# EAGLE design p1-001 (EAGLE 9.6.2)
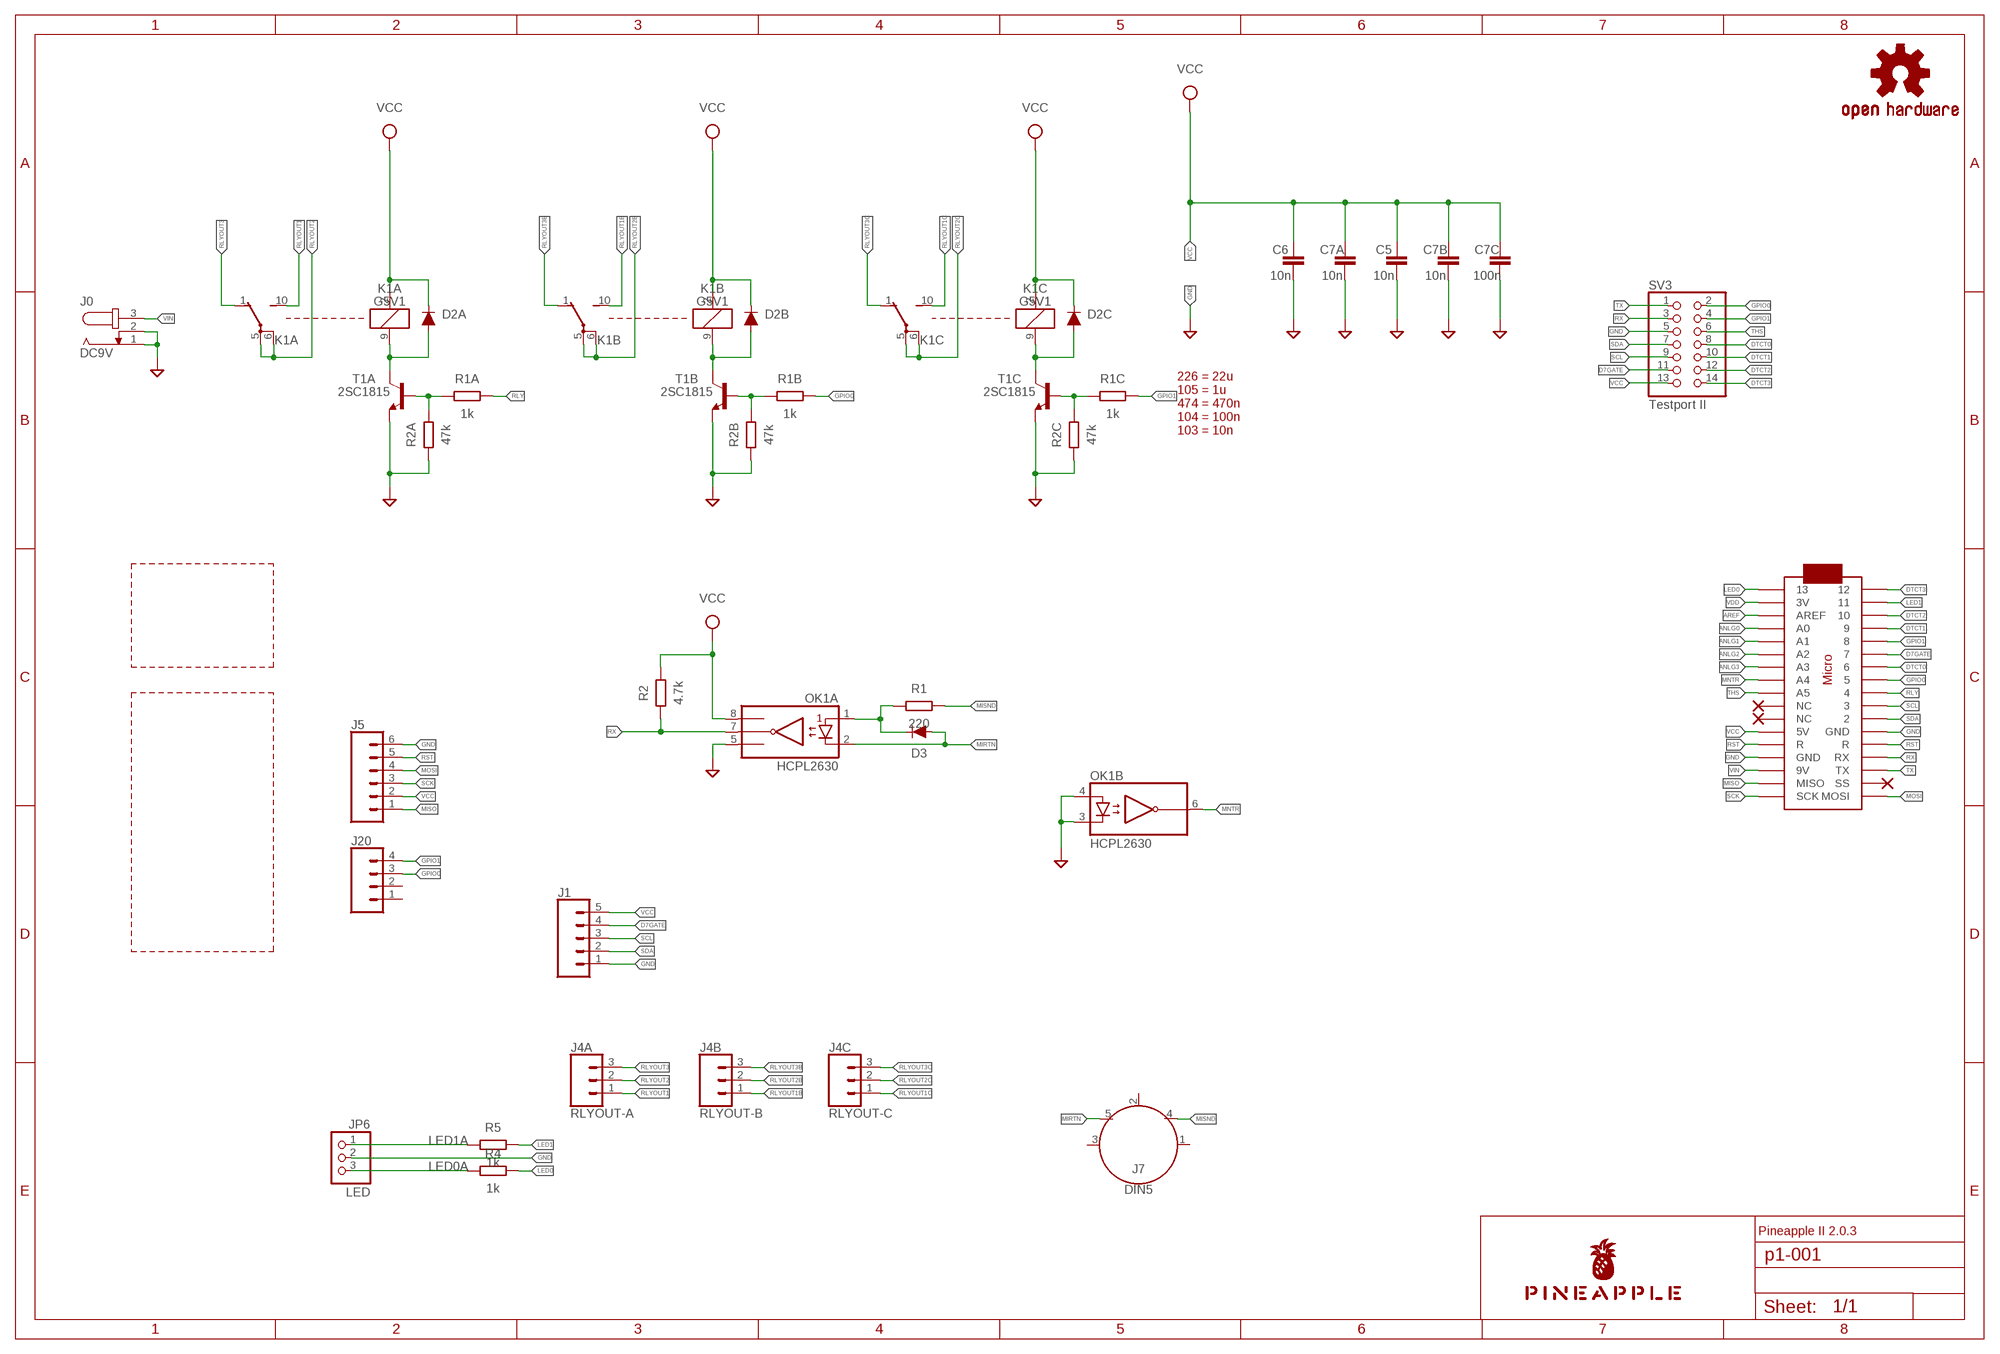
[diagram p0: schematic, sheet 1]

## Parts
C5  10n  C-EU025-024X044  [C025-024X044]
C6  10n  C-EU025-024X044  [C025-024X044]
C7A  10n  C-EU025-024X044  [C025-024X044]
C7B  10n  C-EU025-024X044  [C025-024X044]
C7C  100n  C-EU025-024X044  [C025-024X044]
D2A  DIODE-1N4148  [DIODE-1N4148]
D2B  DIODE-1N4148  [DIODE-1N4148]
D2C  DIODE-1N4148  [DIODE-1N4148]
D3  DIODE-1N4148  [DIODE-1N4148]
J0  DC9V  JACK-PLUG0  [SPC4077]
J1  CONN_05JST  [JST-5-PTH]
J4A  RLYOUT-A  CONN_03JST-PTH  [JST-3-PTH]
J4B  RLYOUT-B  CONN_03JST-PTH  [JST-3-PTH]
J4C  RLYOUT-C  CONN_03JST-PTH  [JST-3-PTH]
J5  CONN_061.27MM  [1X06_1.27MM]
J7  DIN5  [DIN5-RA-PTH]
J20  CONN_041.27MM  [1X04_1.27MM]
JP6  LED  PINHD-1X3  [1X03]
K1A  G5V1  [G5V1]
K1B  G5V1  [G5V1]
K1C  G5V1  [G5V1]
LOGO1  OSHW-LOGOS-COPPER  [OSHW-LOGO-S_COPPER]
MC1  ARDUINOMICRO  [ARDUINOMICRO]
OK1  HCPL2630  [DIL08]
R1  220  R-EU_0204/5  [0204/5]
R1A  1k  R-EU_0204/5  [0204/5]
R1B  1k  R-EU_0204/5  [0204/5]
R1C  1k  R-EU_0204/5  [0204/5]
R2  4.7k  R-EU_0204/5  [0204/5]
R2A  47k  R-EU_0204/5  [0204/5]
R2B  47k  R-EU_0204/5  [0204/5]
R2C  47k  R-EU_0204/5  [0204/5]
R4  1k  R-EU_0204/5  [0204/5]
R5  1k  R-EU_0204/5  [0204/5]
SV3  Testport II  PINHD-2X7  [2X07]
T1A  2SC1815  [TO92-ECB]
T1B  2SC1815  [TO92-ECB]
T1C  2SC1815  [TO92-ECB]
U$1  PINEAPPLE450_SILK  [PINEAPPLE450_SILK]

## Nets
ANLG0 [analog]: MC1.P$31(A0)
ANLG1 [analog]: MC1.P$30(A1)
ANLG2 [analog]: MC1.P$29(A2)
ANLG3 [analog]: MC1.P$28(A3)
AREF: MC1.P$32(AREF)
D7GATE: J1.4 MC1.P$6 SV3.11
DTCT0: MC1.P$7 SV3.8
DTCT1: MC1.P$4 SV3.10
DTCT2: MC1.P$3 SV3.12
DTCT3: MC1.P$1 SV3.14
GND [gnd]: C5.2 C6.2 C7A.2 C7B.2 C7C.2 J0.1 J0.2 J1.1 J5.6 JP6.2 MC1.P$12(GND) MC1.P$21(GND) OK1.3(B:C2) OK1.4(B:A2) OK1.5(A:GND) R2A.1 R2B.1 R2C.1 SV3.5 T1A.E T1B.E T1C.E
GPIO0: J20.3 MC1.P$8 R1B.2 SV3.2
GPIO1: J20.4 MC1.P$5 R1C.2 SV3.4
LED0: MC1.P$34 R4.2
LED0A: JP6.3 R4.1
LED1: MC1.P$2 R5.2
LED1A: JP6.1 R5.1
MIDIINSND: D3.C OK1.1(A:A1) R1.1
MIRTN: D3.A J7.5 OK1.2(A:C1)
MISND: J7.4 R1.2
MISO: J5.1 MC1.P$19(MISO)
MNTR: MC1.P$27(A4) OK1.6(B:VO2)
MOSI: J5.4 MC1.P$17(MOSI)
RLY: MC1.P$9 R1A.2
RLYDRV: R1A.1 R2A.2 T1A.B
RLYDRV1: R1B.1 R2B.2 T1B.B
RLYDRV2: R1C.1 R2C.2 T1C.B
RLYOUT1: J4A.1 K1A.10(2:S)
RLYOUT1B: J4B.1 K1B.10(2:S)
RLYOUT1C: J4C.1 K1C.10(2:S)
RLYOUT2: J4A.2 K1A.5(2:P) K1A.6(2:P)
RLYOUT2B: J4B.2 K1B.5(2:P) K1B.6(2:P)
RLYOUT2C: J4C.2 K1C.5(2:P) K1C.6(2:P)
RLYOUT3: J4A.3 K1A.1(2:O)
RLYOUT3B: J4B.3 K1B.1(2:O)
RLYOUT3C: J4C.3 K1C.1(2:O)
RLYSNK: D2A.A K1A.9 T1A.C
RLYSNK1: D2B.A K1B.9 T1B.C
RLYSNK2: D2C.A K1C.9 T1C.C
RST: J5.5 MC1.P$13(R) MC1.P$22(R)
RX: MC1.P$14(RX) OK1.7(A:VO1) R2.1 SV3.3
SCK: J5.3 MC1.P$18(SCK)
SCL: J1.3 MC1.P$10 SV3.9
SDA: J1.2 MC1.P$11 SV3.7
THS: MC1.P$26(A5) SV3.6
TX: MC1.P$15(TX) SV3.1
VCC [power]: C5.1 C6.1 C7A.1 C7B.1 C7C.1 D2A.C D2B.C D2C.C J1.5 J5.2 K1A.2 K1B.2 K1C.2 MC1.P$23(5V) OK1.8(A:VCC) R2.2 SV3.13
VDD [power]: MC1.P$33(3V)
VIN [superpower]: J0.3 MC1.P$20(9V)
Unconnected: J7.1 J7.2 J7.3 J20.1 J20.2 MC1.P$16(SS) MC1.P$24(NC) MC1.P$25(NC)

## Notes on the sheet
- 226 = 22u
  105 = 1u
  474 = 470n
  104 = 100n
  103 = 10n
- Pineapple II 2.0.3

## Library data of the parts
C5 C6 C7A C7B C7C = resistor:C-EU: CAPACITOR, European symbol
D2A D2B D2C D3 = SparkFun-DiscreteSemi:DIODE: Diode These are standard reverse protection diodes and small signal diodes. SparkFun Products: SparkFun SparkPunk Sound Kit <https://www.sparkfun.com/products/11177> SparkFun ESP8266 Thing <https://www.sparkfun.com/products/13231>; PROD_ID: DIO-08378; VALUE: 200mA/100V/1V
J0 = con-jack:JACK-PLUG: DC POWER JACK Power Jack, DC, Right Angle, Through Hole, Rated 5A at 16VDC, PC Terminals Distributor: Farnell (www.Farnell.de) Drawing: 84N1161.pdf / 84N1162.pdf Manufacturer: SPC Technology (www.spctechnology.com) Type: SPC4077 / SPC 4078; OC_FARNELL: unknown; OC_NEWARK: unknown
J1 = SparkFun-Connectors:CONN_05: Multi connection point. Often used as Generic Header-pin footprint for 0.1 inch spaced/style header connections On any of the 0.1 inch spaced packages, you can populate with these: Break Away Headers - Straight <https://www.sparkfun.com/products/116> (PRT-00116) Break Away Male Headers - Right Angle <https://www.sparkfun.com/products/553> (PRT-00553) Female Headers <https://www.sparkfun.com/products/115> (PRT-00115) Break Away Headers - Machine Pin <https://www.sparkfun.com/products/117> (PRT-00117) Break Away Female Headers - Swiss Machine Pin <https://www.sparkfun.com/products/743> (PRT-00743) For SCREWTERMINALS and SPRING TERMINALS visit here: Screw Terimnals on SparkFun.com <https://www.sparkfun.com/search/results?term=Screw+Terminals> (5mm/3.5mm/2.54mm spacing) This device is also useful as a general connection point to wire up your design to another part of your project. Our various solder wires solder well into these plated through hole pads. Hook-Up Wire - Assortment (Stranded, 22 AWG) <https://www.sparkfun.com/products/11375> (PRT-11375) Hook-Up Wire - Assortment (Solid Core, 22 AWG) <https://www.sparkfun.com/products/11367> (PRT-11367) View the entire wire category on our website here <https://www.sparkfun.com/categories/141> Special notes: Molex polarized connector foot print use with SKU : PRT-08231 with associated crimp pins and housings. 1MM SMD Version SKU: PRT-10208; SF_ID: PRT-09917
J4A J4B J4C = SparkFun-Connectors:CONN_03: Multi connection point. Often used as Generic Header-pin footprint for 0.1 inch spaced/style header connections On any of the 0.1 inch spaced packages, you can populate with these: Break Away Headers - Straight <https://www.sparkfun.com/products/116> (PRT-00116) Break Away Male Headers - Right Angle <https://www.sparkfun.com/products/553> (PRT-00553) Female Headers <https://www.sparkfun.com/products/115> (PRT-00115) Break Away Headers - Machine Pin <https://www.sparkfun.com/products/117> (PRT-00117) Break Away Female Headers - Swiss Machine Pin <https://www.sparkfun.com/products/743> (PRT-00743) Stackable Header - 3 Pin (Female, 0.1") <https://www.sparkfun.com/products/13875> (PRT-13875) For SCREWTERMINALS and SPRING TERMINALS visit here: Screw Terimnals on SparkFun.com <https://www.sparkfun.com/search/results?term=Screw+Terminals> (5mm/3.5mm/2.54mm spacing) This device is also useful as a general connection point to wire up your design to another part of your project. Our various solder wires solder well into these plated through hole pads. Hook-Up Wire - Assortment (Stranded, 22 AWG) <https://www.sparkfun.com/products/11375> (PRT-11375) Hook-Up Wire - Assortment (Solid Core, 22 AWG) <https://www.sparkfun.com/products/11367> (PRT-11367) View the entire wire category on our website here <https://www.sparkfun.com/categories/141> Special notes: Molex polarized connector foot print use with SKU : PRT-08232 with associated crimp pins and housings.; PROD_ID: WIRE-10037; SF_ID: PRT-09915
J5 = SparkFun-Connectors:CONN_06: Multi connection point. Often used as Generic Header-pin footprint for 0.1 inch spaced/style header connections On any of the 0.1 inch spaced packages, you can populate with these: Break Away Headers - Straight <https://www.sparkfun.com/products/116> (PRT-00116) Break Away Male Headers - Right Angle <https://www.sparkfun.com/products/553> (PRT-00553) Female Headers <https://www.sparkfun.com/products/115> (PRT-00115) Break Away Headers - Machine Pin <https://www.sparkfun.com/products/117> (PRT-00117) Break Away Female Headers - Swiss Machine Pin <https://www.sparkfun.com/products/743> (PRT-00743) Arduino Stackable Header - 6 Pin <https://www.sparkfun.com/products/9280> (PRT-09280) For SCREWTERMINALS and SPRING TERMINALS visit here: Screw Terimnals on SparkFun.com <https://www.sparkfun.com/search/results?term=Screw+Terminals> (5mm/3.5mm/2.54mm spacing) This device is also useful as a general connection point to wire up your design to another part of your project. Our various solder wires solder well into these plated through hole pads. Hook-Up Wire - Assortment (Stranded, 22 AWG) <https://www.sparkfun.com/products/11375> (PRT-11375) Hook-Up Wire - Assortment (Solid Core, 22 AWG) <https://www.sparkfun.com/products/11367> (PRT-11367) View the entire wire category on our website here <https://www.sparkfun.com/categories/141>
J7 = SparkFun-Connectors:DIN5: DIN5 Connector - Female Right Angle (frequently used as a MIDI Jack connector) This type of connector and cable is frequently used for transmitting midi data (musical instrument digital interface). It is what you usually see on a keyboard or set of electronic drums. Learn more here <https://en.wikipedia.org/wiki/MIDI>. For more information on the pinout and electrical specifications of MIDI communications, please see the following resource: https://www.midi.org/specifications/item/midi-din-electrical-specification Here is the connector we sell at SparkFun: MIDI Connector - Female Right Angle <https://www.sparkfun.com/products/9536> (PRT-09536) Datasheet <hhttp://www.sparkfun.com/datasheets/Prototyping/Connectors/MIDI-RA.pdf> It is used on this SparkFun product: SparkFun MIDI Shield <https://www.sparkfun.com/products/12898> (DEV-12898); PROD_ID: CONN-09481
J20 = SparkFun-Connectors:CONN_04: Multi connection point. Often used as Generic Header-pin footprint for 0.1 inch spaced/style header connections On any of the 0.1 inch spaced packages, you can populate with these: Break Away Headers - Straight <https://www.sparkfun.com/products/116> (PRT-00116) Break Away Male Headers - Right Angle <https://www.sparkfun.com/products/553> (PRT-00553) Female Headers <https://www.sparkfun.com/products/115> (PRT-00115) Break Away Headers - Machine Pin <https://www.sparkfun.com/products/117> (PRT-00117) Break Away Female Headers - Swiss Machine Pin <https://www.sparkfun.com/products/743> (PRT-00743) For SCREWTERMINALS and SPRING TERMINALS visit here: Screw Terimnals on SparkFun.com <https://www.sparkfun.com/search/results?term=Screw+Terminals> (5mm/3.5mm/2.54mm spacing) This device is also useful as a general connection point to wire up your design to another part of your project. Our various solder wires solder well into these plated through hole pads. Hook-Up Wire - Assortment (Stranded, 22 AWG) <https://www.sparkfun.com/products/11375> (PRT-11375) Hook-Up Wire - Assortment (Solid Core, 22 AWG) <https://www.sparkfun.com/products/11367> (PRT-11367) View the entire wire category on our website here <https://www.sparkfun.com/categories/141> Special notes: Molex polarized connector foot print use with SKU : PRT-08231 with associated crimp pins and housings. 1MM SMD Version SKU: PRT-10208
JP6 = pinhead:PINHD-1X3: PIN HEADER
K1A K1B K1C = relay:G5V1: RELAY 1 x switch, 0.5 A/125 V AC, 1 A/24 V DC , Omron; MPN: G5V-1-DC24; OC_FARNELL: 9949593; OC_NEWARK: 36M6377
LOGO1 = SparkFun-Aesthetics:OSHW-LOGO: Open-Source Hardware (OSHW) Logo This logo indicates the piece of hardware it is found on incorporates a OSHW license and/or adheres to the definition of open source hardware found here: http://freedomdefined.org/OSHW
MC1 = adafruit:ARDUINOMICRO
OK1 = optocoupler:HCPL2630: HEWLETT PACKARD OPTO COUPLER; MF: AGILENT TECHNOLOGIES; MPN: HCPL-2630-000E; OC_FARNELL: 9994904; OC_NEWARK: 88H7813
R1 R1A R1B R1C R2 R2A R2B R2C R4 R5 = resistor:R-EU_: RESISTOR, European symbol
SV3 = pinhead:PINHD-2X7: PIN HEADER
T1A T1B T1C = transistor:2SC1815: NPN EPITAXIAL TRANSISTOR Source: TOSHIBA .. 2SC1815 1.pdf
U$1 = pineapple:PINEAPPLE450_SILK

## Net classes
0 default: width 0.152 mm, drill 0.152 mm, clearance 0.152 mm
1 gnd: width 0.305 mm, drill 0.152 mm, clearance 0.152 mm
2 power: width 0.508 mm, drill 0.152 mm, clearance 0.152 mm
3 analog: width 0.305 mm, drill 0.152 mm, clearance 0.152 mm
4 superpower: width 1.016 mm, drill 0.152 mm, clearance 0.152 mm

## Board
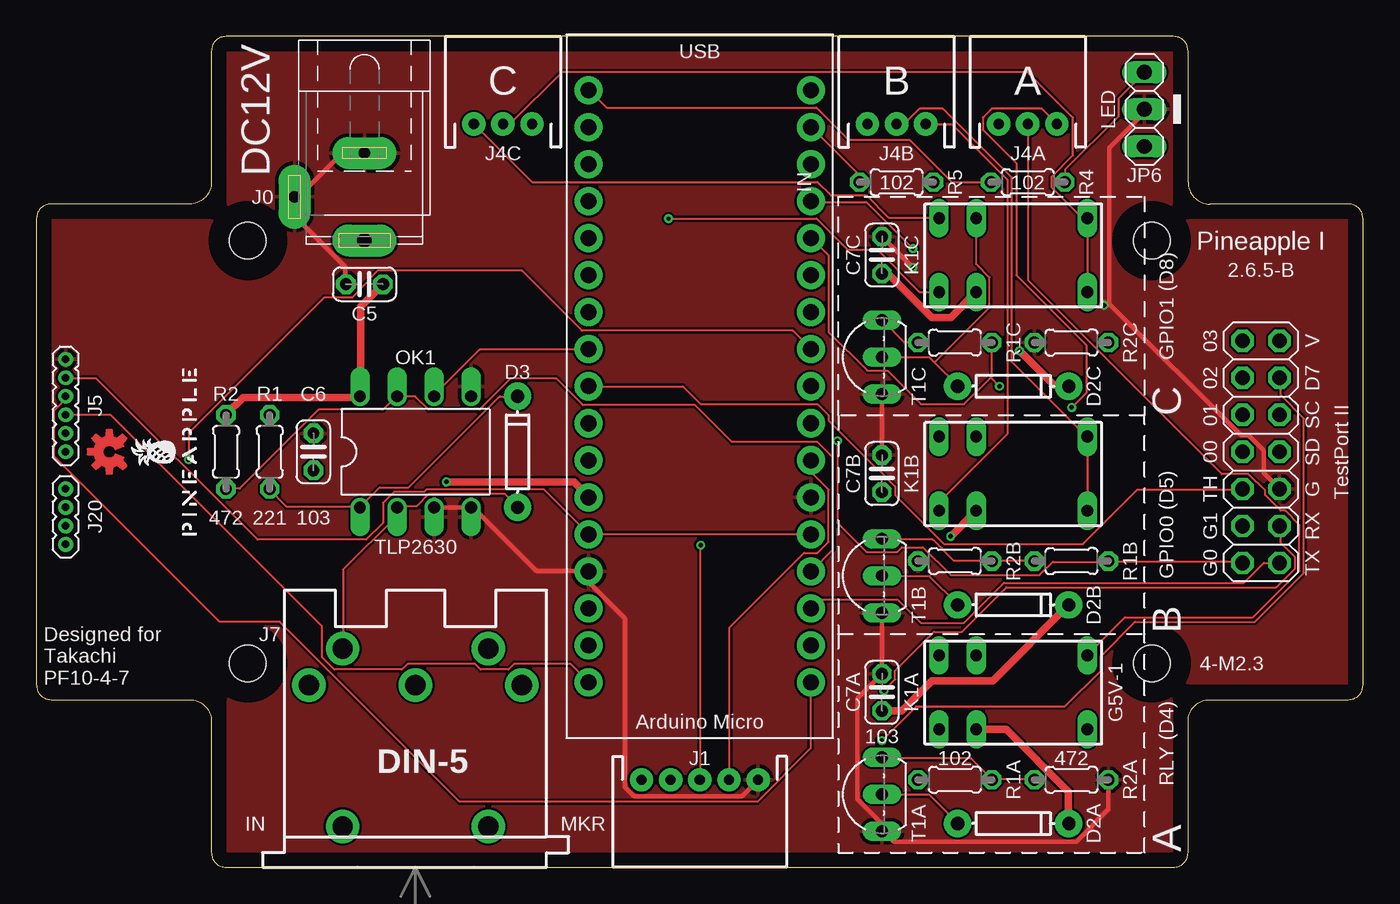
[diagram p1: board, top side]
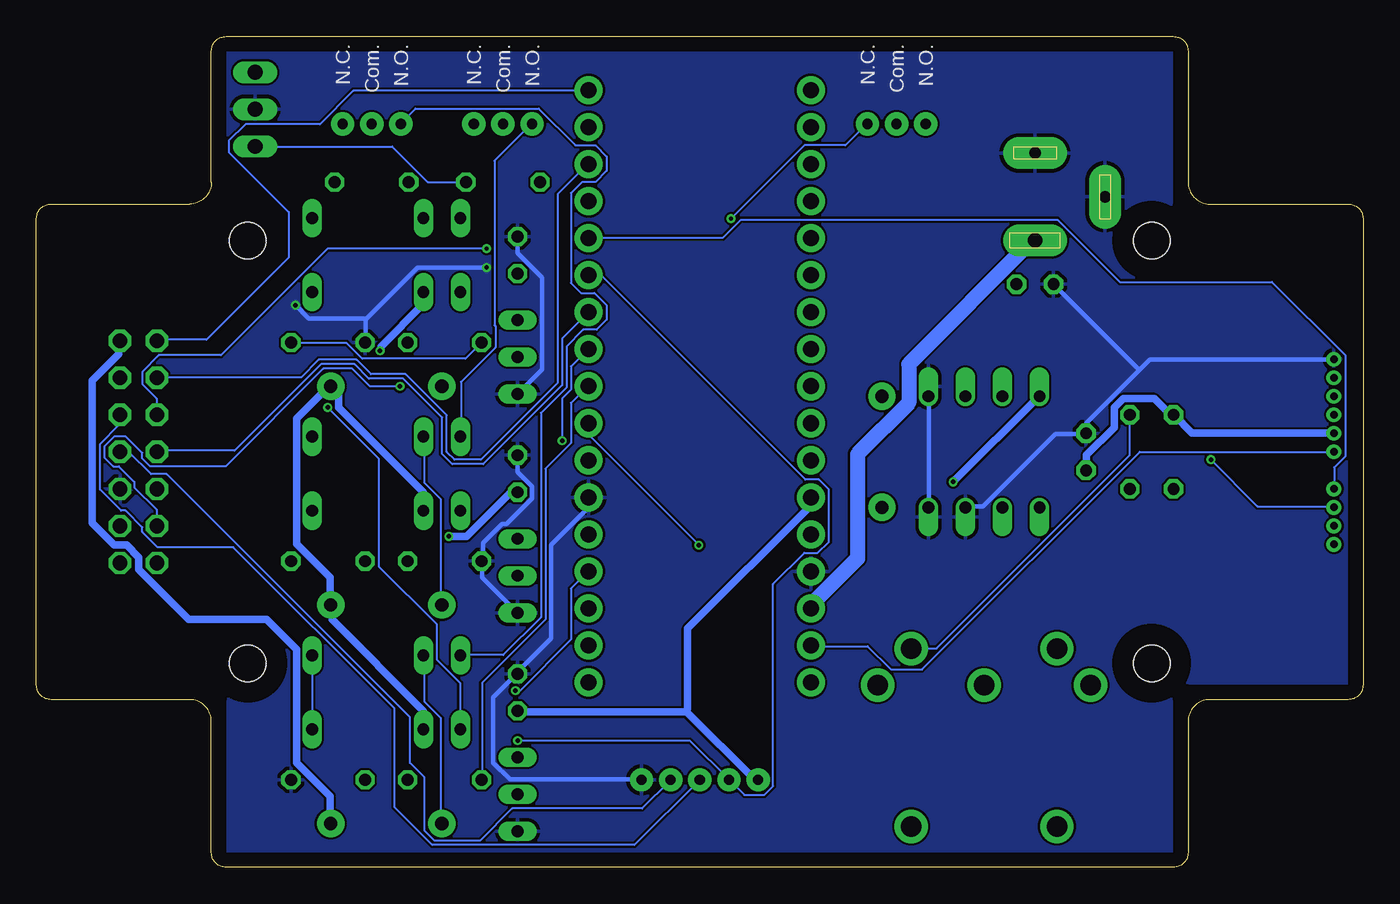
[diagram p2: board, bottom side, seen from below]

Size 91 x 57 mm. Coordinates in mm from the lower left corner, seen from the top.
Outline: 78,57 13,57 arc90 12,56 12,47 arc-90 10.5,45.5 1,45.5 arc90 0,44.5 0,12.5 arc90 1,11.5 10.5,11.5 arc-90 12,10 12,1 arc90 13,0 78,0 arc90 79,1 79,10 arc-90 80.5,11.5 90,11.5 arc90 91,12.5 91,44.5 arc90 90,45.5 80.5,45.5 arc-90 79,47 79,56 arc90 78,57
Copper layers (1*16): Top 0.035mm / dielectric 1.5mm / Bottom 0.035mm
Design rules "SeeedStudio_2layer_DRU_no_angle_20140221": minimum track width 6mil, minimum drill 12mil, track to track 6mil, track to pad 6mil, pad to pad 6mil, via to via 6mil, smd to smd 0mil, copper to edge 10mil, drill to drill 10mil, minimum pad ring 10mil, minimum via ring 6mil, stop-mask expansion 2mil, vias tented up to drill 100mil, thermal gap 10mil
Holes 2.5 mm at 76.5,43 14.5,43 14.5,14 76.5,14
tRestrict: area 11.9,40.4 to 17.1,45.6; area 73.9,40.4 to 79.1,45.6; area 11.9,11.4 to 17.1,16.6; area 73.9,11.4 to 79.1,16.6; area 12,56 to 79,57; area 90,11.5 to 91,45.5; area 12,0 to 79,1; area 0,11.5 to 1,45.5; area 0,44.5 to 12,45.5; area 12,45.5 to 13,57; area 78,45.5 to 79,57; area 79,44.5 to 91,45.5; 8 more areas
bRestrict: area 11.9,11.4 to 17.1,16.6; area 73.9,11.4 to 79.1,16.6; area 73.9,40.4 to 79.1,45.6; area 11.9,40.4 to 17.1,45.6; area 78,0 to 79,11.5; area 79,11.5 to 91,12.5; area 90,11.5 to 91,45.5; area 79,44.5 to 91,45.5; area 78,45.5 to 79,57; area 12,56 to 79,57; area 12,45.5 to 13,57; area 0,44.5 to 12,45.5; 8 more areas

### Footprints (pad centres in the part's own frame; a part is rotated, then mirrored left to right if it is on the bottom)
C025-024X044 = drill 0.813 octagon: 1 -1.27,0; 2 1.27,0
DIODE-1N4148 = drill 0.9 pad 1.88: A -3.81,0; C 3.81,0
SPC4077 = drill 0.8 pad 2.184 long: 1 -3,0; 2 0,-4.8 | drill 1 pad 2.184 long: 3 3,0
JST-5-PTH = drill 0.7 pad 1.6: 1 -4,0; 2 -2,0; 3 0,0; 4 2,0; 5 4,0
JST-3-PTH = drill 0.7 pad 1.6: 1 -2,0; 2 0,0; 3 2,0
1X06_1.27MM = drill 0.508 pad 1: 1 0,0; 2 1.27,0; 3 2.54,0; 4 3.81,0; 5 5.08,0; 6 6.35,0
DIN5-RA-PTH = drill 1.4 pad 2.286: 1 7.3,12.5; 2 0,12.5; 3 -7.3,12.5; 4 5,15; 5 -5,15; 6 -5,2.8; 7 5,2.8
1X04_1.27MM = drill 0.508 pad 1: 1 0,0; 2 1.27,0; 3 2.54,0; 4 3.81,0
1X03 = drill 1.016 long: 1 -2.54,0; 2 0,0; 3 2.54,0
G5V1 = drill 0.813 long: 1 -5.08,-2.54; 2 -2.54,-2.54; 5 5.08,-2.54; 6 5.08,2.54; 9 -2.54,2.54; 10 -5.08,2.54
ARDUINOMICRO = drill 1.1 pad 1.93: P$1 -20.32,7.62; P$2 -17.78,7.62; P$3 -15.24,7.62; P$4 -12.7,7.62; P$5 -10.16,7.62; P$6 -7.62,7.62; P$7 -5.08,7.62; P$8 -2.54,7.62; P$9 0,7.62; P$10 2.54,7.62; P$11 5.08,7.62; P$12 12.7,-7.62; P$13 10.16,-7.62; P$14 12.7,7.62; P$15 15.24,7.62; P$16 17.78,7.62; P$17 20.32,7.62; P$18 20.32,-7.62; P$19 17.78,-7.62; P$20 15.24,-7.62; P$21 7.62,7.62; P$22 10.16,7.62; P$23 7.62,-7.62; P$24 5.08,-7.62; P$25 2.54,-7.62; P$26 0,-7.62; P$27 -2.54,-7.62; P$28 -5.08,-7.62; P$29 -7.62,-7.62; P$30 -10.16,-7.62; P$31 -12.7,-7.62; P$32 -15.24,-7.62; P$33 -17.78,-7.62; P$34 -20.32,-7.62
DIL08 = drill 0.813 offset: 1 -3.81,-3.81; 2 -1.27,-3.81; 3 1.27,-3.81; 4 3.81,-3.81; 5 3.81,3.81; 6 1.27,3.81; 7 -1.27,3.81; 8 -3.81,3.81
0204/5 = drill 0.813 octagon: 1 -2.54,0; 2 2.54,0
2X07 = drill 1.016 octagon: 1 -7.62,-1.27; 2 -7.62,1.27; 3 -5.08,-1.27; 4 -5.08,1.27; 5 -2.54,-1.27; 6 -2.54,1.27; 7 0,-1.27; 8 0,1.27; 9 2.54,-1.27; 10 2.54,1.27; 11 5.08,-1.27; 12 5.08,1.27; 13 7.62,-1.27; 14 7.62,1.27
TO92-ECB = drill 0.813 long: B 2.54,0; C 0,0; E -2.54,0

### Placement (x,y rotation side)
C5  22.5,40 180 top
C6  19,28.5 90 top
C7A  58,12 90 top
C7B  58,27 90 top
C7C  58,42 90 top
D2A  67,3 0 top
D2B  67,18 0 top
D2C  67,33 0 top
D3  33,28.5 90 top
J0  22.5,46 270 top
J1  45.5,6 180 top
J4A  68,51 0 top
J4B  59,51 0 top
J4C  32,51 0 top
J5  2,28.5 90 top
J7  26,0 0 top
J20  2,22.15 90 top
JP6  76,52 90 top
K1A  67,12 0 top
K1B  67,27 0 top
K1C  67,42 0 top
LOGO1  5,28.5 90 top
MC1  45.5,33 270 top
OK1  26,28.5 0 top
R1  16,28.5 90 top
R1A  63,6 180 top
R1B  71,21 0 top
R1C  63,36 0 top
R2  13,28.5 90 top
R2A  71,6 180 top
R2B  63,21 0 top
R2C  71,36 0 top
R4  68,47 180 top
R5  59,47 180 top
SV3  84,28.5 90 top
T1A  58,5 90 top
T1B  58,20 90 top
T1C  58,35 90 top
U$1  11,28.5 90 top

### Tracks (layer width: path | path; a pad name or v marks a point on that pad's centre or on a via)
D7GATE  (via drill 0.3)
  Top 0.152: v57.99,8.69 60.35,11.05 70.56,11.05 73,13.49 73,14.48 75.36,16.84 83.59,16.84 86.94,20.19 86.94,30.79 85.34,32.38 85.34,33.53 SV3.11
  Bottom 0.152: v57.99,8.69 46.18,8.69 43.51,6.02 J1.4 43.43,5.94 42.44,4.95 41.07,4.95 40.46,5.56 40.46,19.43 38.33,21.57 37.41,21.57 36.65,22.33 36.65,25.91 37.34,26.59 38.25,26.59 52.27,40.62 MC1.P$6
DTCT0
  Bottom 0.152: SV3.8 82.68,28.57 77.42,28.57 71.48,34.52 69.19,34.52 68.2,33.53 65.84,33.53 63.17,30.86 63.17,28.35 62.48,27.66 60.35,27.66 54.94,33.07 54.94,36.27 53.19,38.02 MC1.P$7
DTCT1  (via drill 0.3)
  Top 0.152: v60.12,42.44 56.92,45.64 53.19,45.64 MC1.P$4
  Bottom 0.152: v60.12,42.44 71.02,42.44 78.33,35.13 82.6,35.13 83.74,33.98 83.74,33.15 82.75,32.16 82.75,31.09 SV3.10
DTCT2
  Bottom 0.152: SV3.12 82.68,33.6 72.85,33.6 71.63,34.82 69.04,34.82 68.05,33.83 65.68,33.83 62.87,31.01 62.87,28.5 62.33,27.96 60.5,27.96 55.24,33.22 55.24,46.18 53.19,48.23 MC1.P$3
DTCT3
  Bottom 0.152: SV3.14 82.68,36.2 79.32,36.2 73.69,41.83 73.69,44.96 77.8,49.07 77.8,49.84 76.66,50.98 71.55,50.98 69.27,53.26 53.19,53.26 MC1.P$1
GND  (via drill 0.3)
  Top 0.305: OK1.3 29.79,24.69 OK1.4 29.95,24.69 34.29,20.34 37.87,20.34 MC1.P$12 37.95,20.19 37.95,19.51 40.39,17.07 40.39,5.49 41,4.88 48.39,4.88 49.45,5.94 J1.1 | C5.2 21.18,40.01 21.18,41.22 17.75,44.65 17.75,45.95 J0.2 17.91,45.95 20.95,49 22.48,49 J0.1 | 73.61,38.63 73.61,49.38 75.97,51.74 75.97,51.97 JP6.2 | 73.61,38.63 82.6,29.64 83.13,29.64 84.2,28.57 84.2,27.05 85.27,25.98 SV3.5 | C7B.2 57.99,28.27 57.99,32.38 T1C.E | v60.12,41.15 58.06,43.2 C7C.2 | T1B.E 57.99,17.45 57.99,13.41 C7A.2 57.99,13.26 56.31,11.58 56.31,4.65 57.99,2.97 57.99,2.52 T1A.E 58.14,2.44 58.83,1.75 71.32,1.75 73.53,3.96 73.53,5.94 R2A.1 | v73.23,38.56 73.53,38.56 73.61,38.63
  Bottom 0.305: OK1.5 29.79,32.31 29.79,24.77 OK1.4 | 15.35,34.1 18.97,30.48 18.97,29.79 C6.2 19.13,29.72 21.11,29.72 26.06,24.77 27.2,24.77 OK1.3 | 15.35,34.1 14.63,34.82 2.06,34.82 J5.6 | 15.35,34.1 21.18,39.93 C5.2 | C7C.2 57.99,43.2 57.99,42.14 56.31,40.46 56.31,34.14 57.99,32.46 T1C.E | 68.43,37.57 68.43,36.04 R2C.1 | 68.43,37.57 64.85,41.15 v60.12,41.15 | T1B.E 58.06,17.53 60.43,19.89 60.43,20.95 R2B.1 60.35,21.11 60.35,22.25 59.05,23.55 58.75,23.55 57,25.3 57,26.14 57.99,27.13 57.99,28.19 C7B.2 | J1.1 49.53,6.02 58.52,6.02 59.66,7.16 59.66,11.66 58.06,13.26 C7A.2 57.99,13.41 55.7,15.7 55.7,22.1 53.19,24.61 53.19,25.38 MC1.P$21 | v73.23,38.56 72.31,37.64 68.5,37.64 68.43,37.57
  pour Top: -1,-1 92,-1 92,58 -1,58
  pour Bottom: -2,-2 93,-2 93,59 -2,59
GPIO0  (via drill 0.3)
  Top 0.152: SV3.2 82.68,20.95 73.61,20.95 R1B.2 73.53,20.95 69.72,20.95 68.81,20.04 62.71,20.04 60.81,21.95 59.36,21.95 59.05,21.64 56.92,21.64 54.94,23.62 v54.94,29.26 | v10.44,27.96 10.44,29.79 19.74,39.09 21.64,39.09 22.86,40.31 22.86,40.39 23.39,40.92 33.3,40.92 37.41,36.8 51.89,36.8 53.11,35.59 MC1.P$8
  Bottom 0.152: v10.44,27.96 7.24,24.77 2.06,24.77 J20.3 | v54.94,29.26 54.94,32.16 54.33,32.77 54.33,34.37 53.19,35.51 MC1.P$8
GPIO1  (via drill 0.3)
  Top 0.152: 65.46,33.6 63.63,31.77 60.66,31.77 58.37,34.06 57,34.06 54.33,36.73 54.33,41.99 53.19,43.13 MC1.P$5 | 65.46,33.6 65.53,33.68 65.53,35.97 R1C.2 | 65.46,33.6 v66.06,32.99
  Bottom 0.152: J20.4 1.98,25.98 1.98,27.43 1.22,28.19 1.22,35.13 6.25,40.16 16.69,40.16 20.95,44.42 42.67,44.42 43.89,43.2 53.11,43.2 MC1.P$5 | v66.06,32.99 68.12,32.99 69.34,34.21 71.32,34.21 78.03,27.51 83.21,27.51 83.74,28.04 83.74,28.42 84.89,29.57 85.65,29.57 86.33,28.88 86.33,28.12 85.72,27.51 85.34,27.51 84.28,26.44 84.28,26.06 82.75,24.54 82.75,23.47 SV3.4
LED0
  Top 0.152: R4.2 65.46,47.02 62.79,47.02 59.89,49.91 55.7,49.91 53.49,52.12 39.09,52.12 37.95,53.26 MC1.P$34
LED0A
  Top 0.152: R4.1 70.56,47.02 70.56,47.85 74.22,51.51 74.22,52.73 75.97,54.48 JP6.3
LED1
  Top 0.152: R5.2 56.39,47.02 56.39,47.55 53.19,50.75 MC1.P$2
LED1A
  Bottom 0.152: R5.1 61.57,47.02 64.16,47.02 66.6,49.45 75.97,49.45 JP6.1
MIDIINSND
  Top 0.152: R1.1 16,25.91 17.14,24.77 22.17,24.77 OK1.1 22.25,24.77 23.55,26.06 25.53,26.06 31.77,32.31 D3.C
MIRTN
  Top 0.152: D3.A 32.99,24.77 32.16,25.6 26.9,25.6 26.06,24.77 24.77,24.77 OK1.2 24.69,24.69 24.69,24.08 21.03,20.42 21.03,15.01 J7.5
MISND
  Bottom 0.152: R1.2 16,31.01 16,28.27 29.26,15.01 30.94,15.01 J7.4
MISO
  Bottom 0.152: J5.1 2.06,28.5 15.32,28.5 30.25,13.56 32.38,13.56 33.98,15.16 37.87,15.16 MC1.P$19
MNTR
  Top 0.152: OK1.6 27.28,32.38 30.4,35.51 37.87,35.51 MC1.P$27
MOSI
  Top 0.152: J5.4 1.98,32.31 1.98,32.08 1.22,31.32 1.22,28.19 12.57,16.84 16.69,16.84 29.03,4.5 49.45,4.5 53.11,8.15 53.11,12.65 MC1.P$17
RLY
  Bottom 0.152: R1A.2 60.43,6.02 60.43,12.65 56.08,16.99 56.08,27.36 54.33,29.11 54.33,31.85 53.19,32.99 MC1.P$9
RLYDRV
  Top 0.152: R2A.2 68.43,6.02 65.61,6.02 R1A.1 65.53,6.02 64.08,7.47 58.06,7.47 T1A.B
RLYDRV1
  Top 0.152: R1B.1 68.43,21.03 65.61,21.03 R2B.2 65.53,21.03 62.94,21.03 61.49,22.48 58.06,22.48 T1B.B
RLYDRV2
  Top 0.152: R1C.1 60.43,36.04 59.51,36.04 58.06,37.49 T1C.B
  Bottom 0.152: R2C.2 73.53,35.97 69.72,35.97 68.66,34.9 61.57,34.9 60.5,35.97 R1C.1
RLYOUT1
  Bottom 0.152: K1A.10 61.87,14.55 58.98,14.55 56.39,17.14 56.39,31.17 54.63,32.92 54.63,35.74 53.49,36.88 52.58,36.88 51.89,37.57 51.89,38.56 52.73,39.4 53.65,39.4 54.33,40.08 54.33,46.25 53.57,47.02 52.65,47.02 51.89,47.78 51.89,48.77 52.65,49.53 54.03,49.53 56.54,52.05 65,52.05 65.99,51.05 J4A.1
RLYOUT1B
  Bottom 0.152: K1B.10 61.87,29.57 61.87,33.3 59.51,35.66 59.51,37.11 59.59,37.19 59.59,48.46 57.07,50.98 J4B.1
RLYOUT1C
  Top 0.152: K1C.10 61.87,44.58 58.45,44.58 56.92,46.1 54.48,46.1 53.57,47.02 33.98,47.02 30.02,50.98 J4C.1
RLYOUT2
  Top 0.152: J4A.2 68.05,50.98 68.05,40.23 81.31,26.98 83.13,26.98 84.28,25.83 84.28,25.53 85.34,24.46 85.65,24.46 86.64,23.47 86.64,20.34 83.44,17.14 74.68,17.14 72.08,14.55 K1A.6
  Bottom 0.152: K1A.5 72.08,9.53 72.08,14.48 K1A.6
RLYOUT2B
  Top 0.152: K1B.5 72.08,29.49 K1B.6 72.01,29.57 66.9,34.67 66.9,47.32 62.18,52.05 60.58,52.05 59.59,51.05 59.05,51.05 J4B.2
RLYOUT2C
  Top 0.152: K1C.5 72.08,39.47 72.08,44.5 K1C.6 72.01,44.58 71.7,44.58 69.65,46.63 69.65,47.4 71.09,48.84 71.09,51.44 67.97,54.56 36.04,54.56 32.54,51.05 32,51.05 J4C.2
RLYOUT3  (via drill 0.3)
  Top 0.152: v71.02,31.55 72.01,32.54 72.01,35.81 67.21,40.62 67.21,48.31 64.92,50.6 64.92,51.44 65.53,52.05 68.96,52.05 69.95,51.05 J4A.3
  Bottom 0.152: v71.02,31.55 67.51,28.04 67.51,20.65 63.55,16.69 63.55,14.25 61.95,12.65 61.95,9.53 K1A.1
RLYOUT3B
  Top 0.152: K1B.1 61.95,24.46 61.95,25.07 66.6,29.72 66.6,47.17 62.79,50.98 61.04,50.98 J4B.3
RLYOUT3C  (via drill 0.3)
  Top 0.152: v43.36,44.5 53.49,44.5 55.63,42.37 57.68,42.37 60.58,39.47 61.87,39.47 K1C.1
  Bottom 0.152: v43.36,44.5 38.33,49.53 35.51,49.53 34.06,50.98 J4C.3
RLYSNK
  Top 0.152: T1A.C 58.06,4.95 61.27,4.95 63.17,3.05 D2A.A
  Bottom 0.152: K1A.9 64.39,14.48 64.39,11.35 63.25,10.21 63.25,3.05 D2A.A
RLYSNK1
  Top 0.152: T1B.C 58.06,19.96 61.27,19.96 63.17,18.06 D2B.A
  Bottom 0.152: K1B.9 64.39,29.49 64.39,26.36 63.25,25.22 63.25,18.06 D2B.A
RLYSNK2
  Top 0.152: 61.61,34.63 63.17,33.07 D2C.A | 61.61,34.63 61.27,34.98 58.06,34.98 T1C.C | 61.61,34.63 65.38,38.41 65.38,40.46 64.47,41.38 64.47,44.5 K1C.9
RST
  Top 0.152: J5.5 2.06,33.53 4.12,33.53 15.16,22.48 22.63,22.48 23.77,23.62 23.77,24.99 24.54,25.76 26.59,25.76 26.75,25.91 34.82,25.91 37.87,22.86 MC1.P$13 37.95,22.86 53.11,22.86 MC1.P$22
RX  (via drill 0.3)
  Top 0.152: R2.1 13.03,25.98 13.95,25.98 19.36,31.39 23.77,31.39 24.69,32.31 OK1.7 24.77,32.31 25.98,32.31 26.9,31.39 30.4,31.39 32.54,33.53 35.66,33.53 37.49,31.7 45.19,31.7 47.7,29.18 53.57,29.18 54.63,28.12 54.63,21.79 53.19,20.34 MC1.P$14 | v58.14,12.12 58.9,12.88 58.9,13.49 61.57,16.15 63.48,16.15 66.52,19.2 85.04,19.2 86.33,20.5 86.33,21.26 85.34,22.25 85.34,23.39 SV3.3
  Bottom 0.152: v58.14,12.12 57.84,12.12 54.33,15.62 54.33,19.13 53.19,20.27 MC1.P$14
SCK
  Top 0.152: J5.3 2.06,31.01 5.11,31.01 19.58,16.54 19.58,14.4 20.42,13.56 25.07,13.56 25.45,13.95 30.1,13.95 30.48,13.56 32.38,13.56 32.77,13.95 36.65,13.95 37.87,12.72 MC1.P$18
SCL  (via drill 0.3)
  Top 0.152: v45.57,22.1 45.57,6.02 J1.3
  Bottom 0.152: SV3.9 85.34,31.01 85.34,30.33 86.64,29.03 86.64,25.91 85.19,24.46 84.89,24.46 83.74,23.32 83.74,23.01 82.68,21.95 77.5,21.95 66.45,10.9 66.45,4.12 63.86,1.52 49.99,1.52 45.57,5.94 J1.3 | v45.57,22.1 53.11,29.64 53.11,30.4 MC1.P$10
SDA
  Top 0.152: MC1.P$11 53.19,27.89 53.19,27.05 54.33,25.91 54.33,22.33 53.57,21.57 52.65,21.57 47.55,16.46 47.55,6.02 J1.2
  Bottom 0.152: SV3.7 84.66,28.5 83.13,26.98 82.07,26.98 65.38,10.29 65.38,7.16 64.39,6.17 64.39,2.52 63.7,1.83 60.58,1.83 58.37,4.04 49.45,4.04 47.55,5.94 J1.2
THS
  Top 0.152: SV3.6 82.68,25.91 75.51,25.91 71.78,22.17 62.26,22.17 58.9,25.53 58.9,26.14 57.68,27.36 57.61,27.36 54.33,30.63 54.33,31.01 53.57,31.77 45.57,31.77 44.35,32.99 37.95,32.99 MC1.P$26
TX
  Top 0.152: SV3.1 84.2,20.88 82.83,19.51 66.37,19.51 63.63,16.76 60.66,16.76 59.05,18.36 53.72,18.36 53.19,17.83 MC1.P$15
VCC  (via drill 0.3)
  Top 0.508: K1A.2 66.52,9.45 70.79,5.18 70.79,3.05 D2A.C | C5.1 23.7,39.93 22.25,38.48 22.25,32.38 OK1.8 21.95,32.23 14.17,32.23 13.03,31.09 R2.2 | C7C.1 58.06,40.69 58.45,40.69 61.42,37.72 62.71,37.72 64.39,39.4 K1C.2 | v62.71,22.71 64.39,24.38 K1B.2 | v67.44,35.43 69.8,33.07 70.79,33.07 D2C.C | C7A.1 58.06,10.74 59.36,10.74 61.42,12.8 65.61,12.8 70.79,17.98 D2B.C | v28.12,26.44 36.88,26.44 37.87,25.45 MC1.P$23
  Bottom 0.508: SV3.13 85.34,36.12 85.34,35.2 87.17,33.38 87.17,23.62 85.65,22.1 84.81,22.1 83.97,21.26 83.97,20.42 80.54,16.99 75.21,16.99 73.15,14.94 73.15,7.16 70.87,4.88 70.87,3.05 D2A.C | J5.2 2.06,29.79 11.73,29.79 12.95,31.01 R2.2 13.26,31.09 14.33,32.16 16.46,32.16 17.07,31.55 17.07,30.18 18.97,28.27 18.97,27.28 C6.1 | K1B.2 64.47,25.76 70.26,31.55 70.26,32.46 70.79,32.99 D2C.C 71.02,32.92 73.15,30.79 73.15,22.17 70.87,19.89 70.87,18.06 D2B.C 70.71,17.75 70.71,16.99 64.47,10.74 64.47,9.53 K1A.2 | v62.71,22.71 61.49,22.71 58.52,25.68 58.06,25.68 C7B.1 | v67.44,35.43 67.36,35.51 67.36,35.74 64.47,38.63 64.47,39.4 K1C.2 | 46.41,10.67 41.76,6.02 41.53,6.02 J1.5 | 46.41,10.67 57.99,10.67 C7A.1 | MC1.P$23 37.95,25.38 37.95,24.77 46.33,16.38 46.33,10.9 46.41,10.67 | v28.12,26.44 22.25,32.31 OK1.8
VIN
  Bottom 1.016: MC1.P$20 37.87,17.83 37.87,17.98 34.67,21.18 34.67,28.35 31.17,31.85 31.17,34.52 22.71,42.98 22.55,42.98 J0.3

### Text on the board
tNames: DC12V | USB | C | B | A | LED | IN | 102 | 102 | Pineapple I | 2.6.5-B | GPIO1 (D8) | 03 | V | 02 | D7 | C | 01 | SC | 00 | SD | TestPort II | TH | G | 472 | 221 | 103 | GPIO0 (D5) | G1 | RX | TLP2630 | G0 | TX | B | Designed for / Takachi / PF10-4-7 | 4-M2.3 | G5V-1 | Arduino Micro | 103 | 102 | 472 | RLY (D4) | IN | MKR | A
bNames: N.O. | Com. | N.C. | N.O. | Com. | N.C. | N.O. | Com. | N.C.